# Altium schematic sheet DarlingtonBJTArray.SchDoc: Darlington BJR Array
size A4; CheckedBy: none; Organization: ORGANIZATION; Address1: ADDRESS 1; Address2: ADDRESS 2; Address3: ADDRESS 3; Address4: ADDRESS 4; Revision: -; SheetNumber: 3; SheetTotal: 5; ENG_APP_DATE: --/--/--; DSN_APP_DATE: --/--/--; CHK_APP_DATE: --/--/--
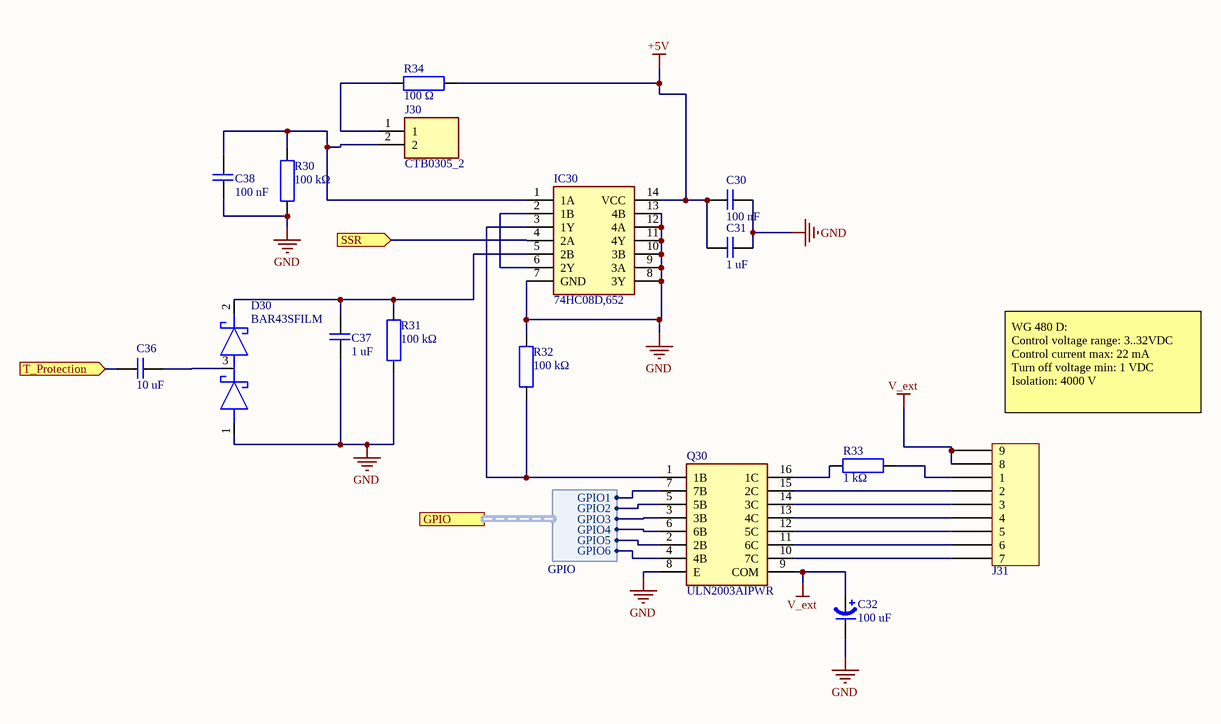
[diagram p0: DarlingtonBJTArray.SchDoc]

## Parts
C30  100 nF  [1206 MLCC]
C31  1 uF  [1206 MLCC]
C32  100 uF  [RADIAL 8x11]
C36  10 uF  [1210 MLCC]
C37  1 uF  [1206 MLCC]
C38  100 nF  [1206 MLCC]
D30  BAR43SFILM  [SOT105P242X150-3N]
IC30  74HC08D,652  [SOIC127P600X175-14N]
J30  CTB0305_2  [CTB03052]
J31  9P terminal block  [9P terminal block 3.50mm]  (value not drawn)
Q30  ULN2003AIPWR  [SOP65P640X120-16N]
R30  100 kΩ  [1206 RES]
R31  100 kΩ  [1206 RES]
R32  100 kΩ  [1206 RES]
R33  1 kΩ  [1206 RES]
R34  100 Ω  [1206 RES]

## Ports
GPIO (harness GPIO), SSR (in), T_Protection (in)

## Harnesses
GPIO: GPIO1, GPIO2, GPIO3, GPIO4, GPIO5, GPIO6

## Nets
+5V: C30.1 C31.1 IC30.14(VCC) R34.1
GND: C30.2 C31.2 C32.2 C37.1 C38.1 D30.1(A) IC30.7(GND) IC30.8(3Y) IC30.9(3A) IC30.10(3B) IC30.11(4Y) IC30.12(4A) IC30.13(4B) Q30.8(E) R30.2 R31.2 R32.1
V_ext: C32.1 J31.8 J31.9 Q30.9(COM)
SSR: IC30.4(2A) ; port SSR
T_Protection: C36.1 ; port T_Protection
NetC36_2: C36.2 D30.3(A)
NetC37_2: C37.2 D30.2(K) IC30.5(2B) R31.1
NetC38_2: C38.2 IC30.1(1A) J30.2 R30.1
NetIC30_2: IC30.2(1B) IC30.6(2Y)
NetIC30_3: IC30.3(1Y) Q30.1(1B) R32.2
NetJ30_1: J30.1 R34.2
NetJ31_1: J31.1 R33.1
NetJ31_2: J31.2 Q30.15(2C)
NetJ31_3: J31.3 Q30.14(3C)
NetJ31_4: J31.4 Q30.13(4C)
NetJ31_5: J31.5 Q30.12(5C)
NetJ31_6: J31.6 Q30.11(6C)
NetJ31_7: J31.7 Q30.10(7C)
NetQ30_2: Q30.2(2B) ; port GPIO.GPIO5
NetQ30_3: Q30.3(3B) ; port GPIO.GPIO3
NetQ30_4: Q30.4(4B) ; port GPIO.GPIO6
NetQ30_5: Q30.5(5B) ; port GPIO.GPIO2
NetQ30_6: Q30.6(6B) ; port GPIO.GPIO4
NetQ30_7: Q30.7(7B) ; port GPIO.GPIO1
NetQ30_16: Q30.16(1C) R33.2

## Notes on the sheet
- (near J31) WG 480 D:
  Control voltage range: 3..32VDC
  Control current max: 22 mA
  Turn off voltage min: 1 VDC
  Isolation: 4000 V
- Project:
- Title:
- Drawn by:
- Date and time:
- Checked by:
- Budapest University of Technology and Economics
- Faculty of Electrical Engineering and Informatics
- Sheet
- of
- Size:
- A4
- Revision:

## Library data of the parts
C30 C31 C36-C38 = Capacitor: Generic MLCC; Manufacturer article no.: *
  C30 C38: Value: 100 nF
  C31 C37: Value: 1 uF
  C36: Value: 10 uF
C32 = Elco: Electrolytic capacitor; Value: 100 uF
D30 = BAR43SFILM: Dual 0.1A small signl schottky; Manufacturer_Name: STMicroelectronics; Datasheet Link: http://www.st.com/st-web-ui/static/active/en/resource/technical/document/datasheet/CD00000764.pdf; Height: 1.5mm; Manufacturer_Part_Number: BAR43SFILM; Mouser Part Number: 511-BAR43SFILM; Mouser Price/Stock: https://www.mouser.co.uk/ProductDetail/STMicroelectronics/BAR43SFILM?qs=QD4S45kuY2oNwRQsBwsPGQ%3D%3D; Arrow Part Number: BAR43SFILM; Arrow Price/Stock: https://www.arrow.com/en/products/bar43sfilm/stmicroelectronics
IC30 = 74HC08D,652: Integrated Circuit; Manufacturer_Name: Nexperia; Datasheet Link: http://www.nxp.com/documents/data_sheet/74HC_HCT08.pdf; Height: 1.75mm; Manufacturer_Part_Number: 74HC08D,652; Mouser Part Number: 771-HC08D652; Mouser Price/Stock: https://www.mouser.co.uk/ProductDetail/Nexperia/74HC08D652?qs=P62ublwmbi%2FiQ9gkrEoLJQ%3D%3D; Arrow Part Number: 74HC08D,652; Arrow Price/Stock: https://www.arrow.com/en/products/74hc08d652/nexperia
J30 = CTB0305_2: Connector; Manufacturer_Name: CamdenBoss Ltd; Manufacturer_Part_Number: CTB0305/2; Datasheet Link: http://www.farnell.com/datasheets/2866628.pdf; Height: 9.1mm; Arrow Part Number: CTB0305/2; Arrow Price/Stock: https://www.arrow.com/en/products/ctb03052/camdenboss-ltd
J31 = 9P terminal block: 3.50mm 9p terminal block
Q30 = ULN2003AIPWR: Transistor; Manufacturer_Name: Texas Instruments; Datasheet Link: http://www.ti.com/lit/gpn/uln2003ai; Height: 1.2mm; Manufacturer_Part_Number: ULN2003AIPWR; Mouser Part Number: 595-ULN2003AIPWR; Mouser Price/Stock: https://www.mouser.co.uk/ProductDetail/Texas-Instruments/ULN2003AIPWR?qs=pbofycSuseO3oIBRA1J7SQ%3D%3D; Arrow Part Number: ULN2003AIPWR; Arrow Price/Stock: https://www.arrow.com/en/products/uln2003aipwr/texas-instruments
R30-R34 = Resitor: Generic SMD resistor
  R30-R32: Value: 100 kΩ
  R33: Value: 1 kΩ
  R34: Value: 100 Ω